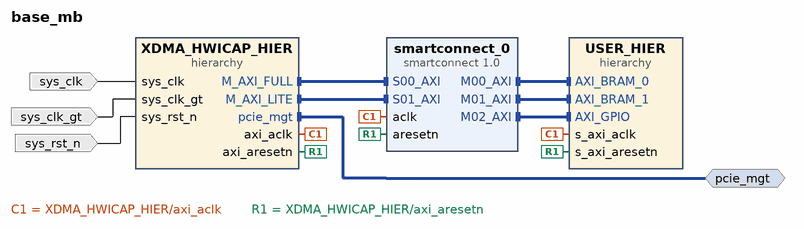
[diagram p0: block diagram of the top level]
# Vivado block design base_mb, xcku035-ffva1156-2-e, Vivado 2021.2
create_bd_design base_mb

create_bd_intf_port -mode Master -vlnv xilinx.com:interface:pcie_7x_mgt_rtl:1.0 pcie_mgt
create_bd_port -dir I -type rst sys_rst_n
create_bd_port -dir I -type clk sys_clk_gt
create_bd_port -dir I -type clk sys_clk

create_bd_cell -type hier XDMA_HWICAP_HIER
create_bd_cell -type ip -vlnv xilinx.com:ip:smartconnect:1.0 smartconnect_0
set_property -dict {CONFIG.NUM_MI 3 CONFIG.NUM_SI 2} [get_bd_cells smartconnect_0]
create_bd_cell -type hier USER_HIER

# ---- hierarchy /XDMA_HWICAP_HIER ----
current_bd_instance /XDMA_HWICAP_HIER
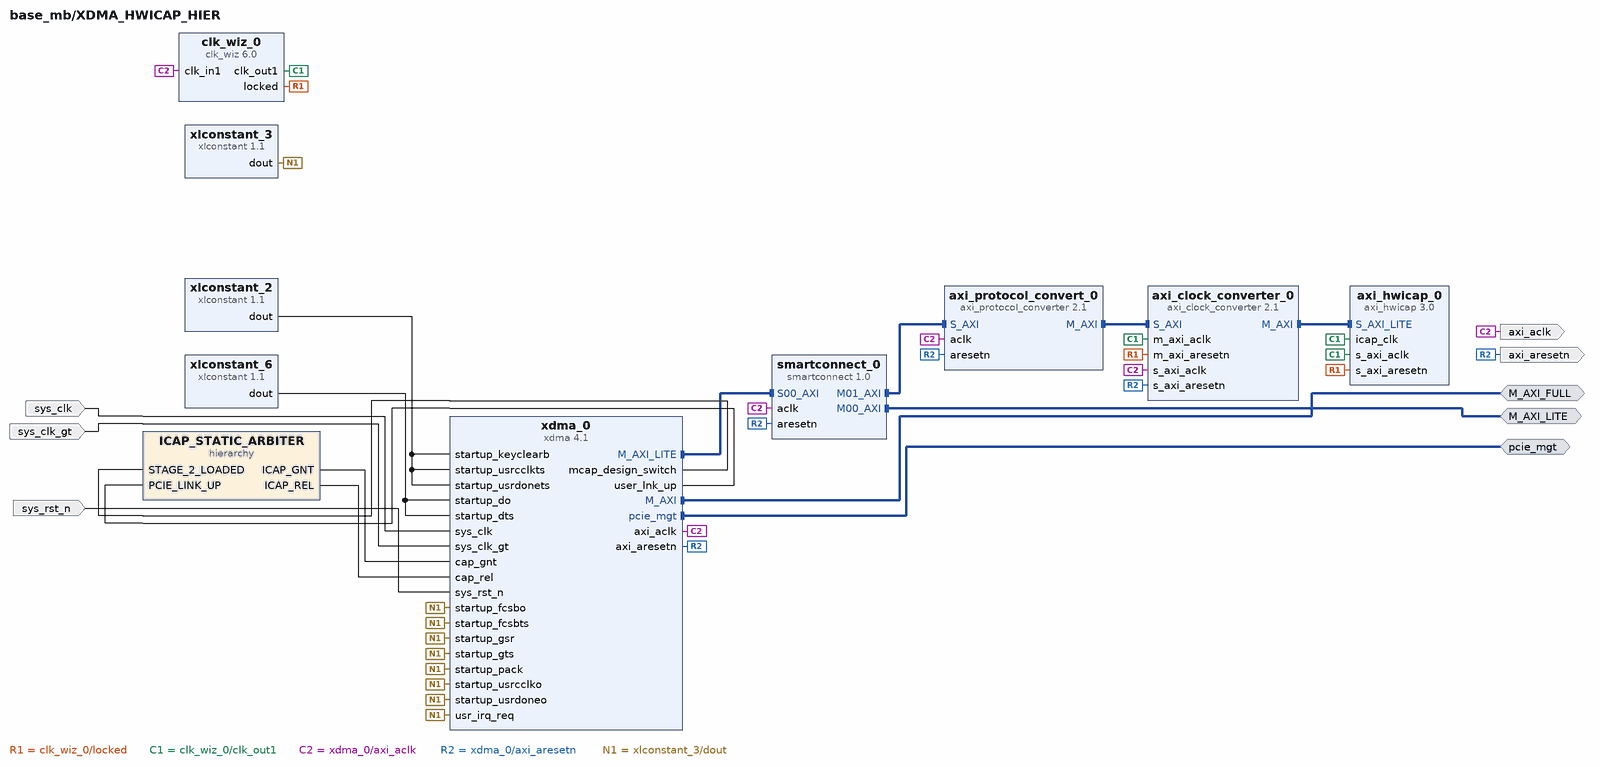
[diagram p1: block diagram inside /XDMA_HWICAP_HIER]
create_bd_intf_pin -mode Master -vlnv xilinx.com:interface:aximm_rtl:1.0 M_AXI_FULL
create_bd_intf_pin -mode Master -vlnv xilinx.com:interface:pcie_7x_mgt_rtl:1.0 pcie_mgt
create_bd_intf_pin -mode Master -vlnv xilinx.com:interface:aximm_rtl:1.0 M_AXI_LITE
create_bd_pin -dir I -type clk sys_clk
create_bd_pin -dir I -type clk sys_clk_gt
create_bd_pin -dir I -type rst sys_rst_n
create_bd_pin -dir O -type clk axi_aclk
create_bd_pin -dir O -type rst axi_aresetn

create_bd_cell -type ip -vlnv xilinx.com:ip:xlconstant:1.1 xlconstant_2
create_bd_cell -type ip -vlnv xilinx.com:ip:xdma:4.1 xdma_0
set_property -dict [list \
  CONFIG.PF0_DEVICE_ID_mqdma 9038 \
  CONFIG.PF0_SRIOV_VF_DEVICE_ID A038 \
  CONFIG.PF2_DEVICE_ID_mqdma 9238 \
  CONFIG.PF3_DEVICE_ID_mqdma 9338 \
  CONFIG.axi_data_width 256_bit \
  CONFIG.axilite_master_en true \
  CONFIG.axilite_master_scale Megabytes \
  CONFIG.axilite_master_size 1 \
  CONFIG.axisten_freq 250 \
  CONFIG.cfg_mgmt_if false \
  CONFIG.dedicate_perst true \
  CONFIG.dma_reset_source_sel Phy_Ready \
  CONFIG.en_gt_selection false \
  CONFIG.en_transceiver_status_ports false \
  CONFIG.enable_pcie_debug False \
  CONFIG.gtcom_in_core_usp 2 \
  CONFIG.mcap_enablement Tandem \
  CONFIG.mode_selection Advanced \
  CONFIG.pcie_blk_locn X0Y0 \
  CONFIG.pcie_extended_tag false \
  CONFIG.pciebar2axibar_axil_master 0xc0000000 \
  CONFIG.pf0_device_id 8038 \
  CONFIG.pf0_link_status_slot_clock_config true \
  CONFIG.pf0_msi_enabled false \
  CONFIG.pl_link_cap_max_link_speed 8.0_GT/s \
  CONFIG.pl_link_cap_max_link_width X8 \
  CONFIG.plltype QPLL1 \
  CONFIG.xdma_axi_intf_mm AXI_Memory_Mapped \
  CONFIG.xdma_axilite_slave false \
  CONFIG.xdma_sts_ports false \
] [get_bd_cells xdma_0]
create_bd_cell -type ip -vlnv xilinx.com:ip:xlconstant:1.1 xlconstant_3
set_property -dict {CONFIG.CONST_VAL 0} [get_bd_cells xlconstant_3]
create_bd_cell -type ip -vlnv xilinx.com:ip:xlconstant:1.1 xlconstant_6
set_property -dict {CONFIG.CONST_VAL 0 CONFIG.CONST_WIDTH 4} [get_bd_cells xlconstant_6]
create_bd_cell -type hier ICAP_STATIC_ARBITER
create_bd_cell -type ip -vlnv xilinx.com:ip:axi_clock_converter:2.1 axi_clock_converter_0
create_bd_cell -type ip -vlnv xilinx.com:ip:axi_protocol_converter:2.1 axi_protocol_convert_0
set_property -dict [list \
  CONFIG.MI_PROTOCOL AXI4LITE \
  CONFIG.SI_PROTOCOL AXI4 \
  CONFIG.TRANSLATION_MODE 2 \
] [get_bd_cells axi_protocol_convert_0]
create_bd_cell -type ip -vlnv xilinx.com:ip:clk_wiz:6.0 clk_wiz_0
set_property -dict [list \
  CONFIG.AUTO_PRIMITIVE PLL \
  CONFIG.CLKOUT1_DRIVES Buffer \
  CONFIG.CLKOUT1_JITTER 107.111 \
  CONFIG.CLKOUT1_PHASE_ERROR 85.928 \
  CONFIG.CLKOUT2_DRIVES Buffer \
  CONFIG.CLKOUT3_DRIVES Buffer \
  CONFIG.CLKOUT4_DRIVES Buffer \
  CONFIG.CLKOUT5_DRIVES Buffer \
  CONFIG.CLKOUT6_DRIVES Buffer \
  CONFIG.CLKOUT7_DRIVES Buffer \
  CONFIG.FEEDBACK_SOURCE FDBK_AUTO \
  CONFIG.MMCM_BANDWIDTH OPTIMIZED \
  CONFIG.MMCM_CLKFBOUT_MULT_F 4 \
  CONFIG.MMCM_CLKIN1_PERIOD 4.000 \
  CONFIG.MMCM_CLKIN2_PERIOD 10.0 \
  CONFIG.MMCM_CLKOUT0_DIVIDE_F 10 \
  CONFIG.MMCM_COMPENSATION AUTO \
  CONFIG.OPTIMIZE_CLOCKING_STRUCTURE_EN true \
  CONFIG.PRIMITIVE Auto \
  CONFIG.USE_LOCKED true \
  CONFIG.USE_RESET false \
] [get_bd_cells clk_wiz_0]
create_bd_cell -type ip -vlnv xilinx.com:ip:axi_hwicap:3.0 axi_hwicap_0
create_bd_cell -type ip -vlnv xilinx.com:ip:smartconnect:1.0 smartconnect_0
set_property -dict {CONFIG.NUM_CLKS 1 CONFIG.NUM_MI 2 CONFIG.NUM_SI 1} [get_bd_cells smartconnect_0]

# ---- hierarchy /XDMA_HWICAP_HIER/ICAP_STATIC_ARBITER ----
current_bd_instance /XDMA_HWICAP_HIER/ICAP_STATIC_ARBITER
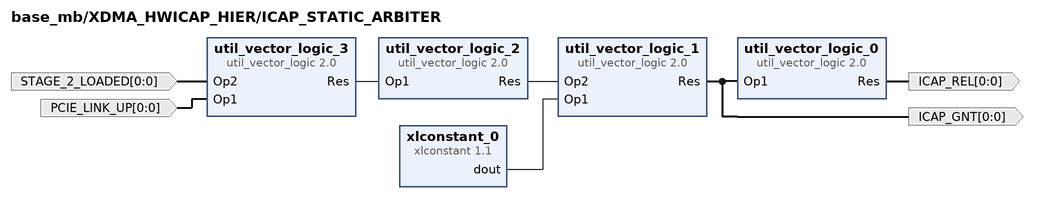
[diagram p2: block diagram inside /XDMA_HWICAP_HIER/ICAP_STATIC_ARBITER]
create_bd_pin -dir O -from 0 -to 0 ICAP_GNT
create_bd_pin -dir I -from 0 -to 0 PCIE_LINK_UP
create_bd_pin -dir I -from 0 -to 0 STAGE_2_LOADED
create_bd_pin -dir O -from 0 -to 0 ICAP_REL

create_bd_cell -type ip -vlnv xilinx.com:ip:xlconstant:1.1 xlconstant_0
create_bd_cell -type ip -vlnv xilinx.com:ip:util_vector_logic:2.0 util_vector_logic_1
set_property -dict {CONFIG.C_SIZE 1} [get_bd_cells util_vector_logic_1]
create_bd_cell -type ip -vlnv xilinx.com:ip:util_vector_logic:2.0 util_vector_logic_2
set_property -dict {CONFIG.C_OPERATION not CONFIG.C_SIZE 1} [get_bd_cells util_vector_logic_2]
create_bd_cell -type ip -vlnv xilinx.com:ip:util_vector_logic:2.0 util_vector_logic_3
set_property -dict {CONFIG.C_SIZE 1} [get_bd_cells util_vector_logic_3]
create_bd_cell -type ip -vlnv xilinx.com:ip:util_vector_logic:2.0 util_vector_logic_0
set_property -dict {CONFIG.C_OPERATION not CONFIG.C_SIZE 1} [get_bd_cells util_vector_logic_0]

# ---- hierarchy /USER_HIER ----
current_bd_instance /USER_HIER
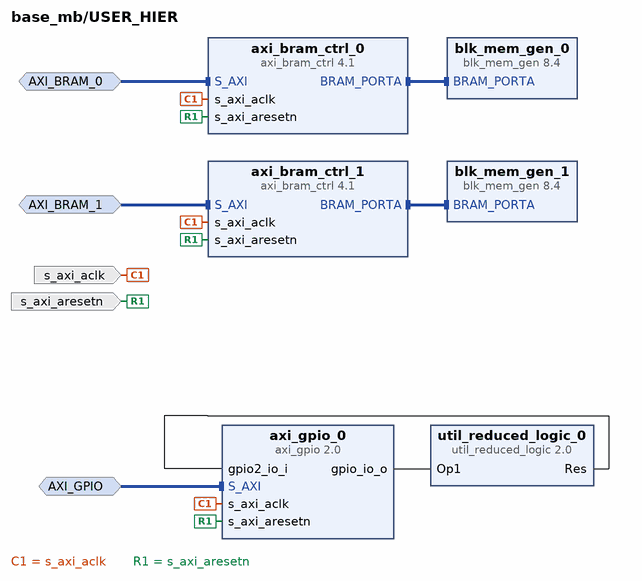
[diagram p3: block diagram inside /USER_HIER]
create_bd_intf_pin -mode Slave -vlnv xilinx.com:interface:aximm_rtl:1.0 AXI_BRAM_0
create_bd_intf_pin -mode Slave -vlnv xilinx.com:interface:aximm_rtl:1.0 AXI_BRAM_1
create_bd_intf_pin -mode Slave -vlnv xilinx.com:interface:aximm_rtl:1.0 AXI_GPIO
create_bd_pin -dir I -type clk s_axi_aclk
create_bd_pin -dir I -type rst s_axi_aresetn

create_bd_cell -type ip -vlnv xilinx.com:ip:axi_bram_ctrl:4.1 axi_bram_ctrl_0
set_property -dict {CONFIG.DATA_WIDTH 256 CONFIG.SINGLE_PORT_BRAM 1} [get_bd_cells axi_bram_ctrl_0]
create_bd_cell -type ip -vlnv xilinx.com:ip:axi_bram_ctrl:4.1 axi_bram_ctrl_1
set_property -dict {CONFIG.SINGLE_PORT_BRAM 1} [get_bd_cells axi_bram_ctrl_1]
create_bd_cell -type ip -vlnv xilinx.com:ip:axi_gpio:2.0 axi_gpio_0
set_property -dict [list \
  CONFIG.C_ALL_INPUTS_2 1 \
  CONFIG.C_ALL_OUTPUTS 1 \
  CONFIG.C_GPIO2_WIDTH 1 \
  CONFIG.C_GPIO_WIDTH 2 \
  CONFIG.C_IS_DUAL 1 \
] [get_bd_cells axi_gpio_0]
create_bd_cell -type ip -vlnv xilinx.com:ip:blk_mem_gen:8.4 blk_mem_gen_0
set_property -dict [list \
  CONFIG.EN_SAFETY_CKT false \
  CONFIG.Memory_Type Single_Port_RAM \
  CONFIG.Port_B_Clock 0 \
  CONFIG.Port_B_Enable_Rate 0 \
  CONFIG.Port_B_Write_Rate 0 \
] [get_bd_cells blk_mem_gen_0]
create_bd_cell -type ip -vlnv xilinx.com:ip:blk_mem_gen:8.4 blk_mem_gen_1
set_property -dict {CONFIG.EN_SAFETY_CKT false} [get_bd_cells blk_mem_gen_1]
create_bd_cell -type ip -vlnv xilinx.com:ip:util_reduced_logic:2.0 util_reduced_logic_0
set_property -dict {CONFIG.C_SIZE 2} [get_bd_cells util_reduced_logic_0]

# ---- connections ----

current_bd_instance /XDMA_HWICAP_HIER
connect_bd_intf_net [get_bd_intf_pins M_AXI_LITE] [get_bd_intf_pins smartconnect_0/M00_AXI]
connect_bd_intf_net [get_bd_intf_pins axi_clock_converter_0/M_AXI] [get_bd_intf_pins axi_hwicap_0/S_AXI_LITE]
connect_bd_intf_net [get_bd_intf_pins axi_protocol_convert_0/M_AXI] [get_bd_intf_pins axi_clock_converter_0/S_AXI]
connect_bd_intf_net [get_bd_intf_pins smartconnect_0/M01_AXI] [get_bd_intf_pins axi_protocol_convert_0/S_AXI]
connect_bd_intf_net [get_bd_intf_pins M_AXI_FULL] [get_bd_intf_pins xdma_0/M_AXI]
connect_bd_intf_net [get_bd_intf_pins xdma_0/M_AXI_LITE] [get_bd_intf_pins smartconnect_0/S00_AXI]
connect_bd_intf_net [get_bd_intf_pins pcie_mgt] [get_bd_intf_pins xdma_0/pcie_mgt]
connect_bd_net [get_bd_pins ICAP_STATIC_ARBITER/ICAP_GNT] [get_bd_pins xdma_0/cap_gnt]
connect_bd_net [get_bd_pins ICAP_STATIC_ARBITER/ICAP_REL] [get_bd_pins xdma_0/cap_rel]
connect_bd_net [get_bd_pins clk_wiz_0/locked] [get_bd_pins axi_hwicap_0/s_axi_aresetn] [get_bd_pins axi_clock_converter_0/m_axi_aresetn]
connect_bd_net [get_bd_pins clk_wiz_0/clk_out1] \
  [get_bd_pins axi_hwicap_0/icap_clk] [get_bd_pins axi_hwicap_0/s_axi_aclk] [get_bd_pins axi_clock_converter_0/m_axi_aclk]
connect_bd_net -net sys_clk_0_1 [get_bd_pins sys_clk] [get_bd_pins xdma_0/sys_clk]
connect_bd_net -net sys_clk_gt_0_1 [get_bd_pins sys_clk_gt] [get_bd_pins xdma_0/sys_clk_gt]
connect_bd_net [get_bd_pins sys_rst_n] [get_bd_pins xdma_0/sys_rst_n]
connect_bd_net [get_bd_pins xdma_0/axi_aclk] \
  [get_bd_pins axi_aclk] [get_bd_pins axi_protocol_convert_0/aclk] [get_bd_pins clk_wiz_0/clk_in1] \
  [get_bd_pins axi_clock_converter_0/s_axi_aclk] [get_bd_pins smartconnect_0/aclk]
connect_bd_net [get_bd_pins xdma_0/axi_aresetn] \
  [get_bd_pins axi_aresetn] [get_bd_pins axi_protocol_convert_0/aresetn] [get_bd_pins axi_clock_converter_0/s_axi_aresetn] \
  [get_bd_pins smartconnect_0/aresetn]
connect_bd_net [get_bd_pins xdma_0/mcap_design_switch] [get_bd_pins ICAP_STATIC_ARBITER/STAGE_2_LOADED]
connect_bd_net [get_bd_pins xdma_0/user_lnk_up] [get_bd_pins ICAP_STATIC_ARBITER/PCIE_LINK_UP]
connect_bd_net [get_bd_pins xlconstant_2/dout] \
  [get_bd_pins xdma_0/startup_keyclearb] [get_bd_pins xdma_0/startup_usrcclkts] [get_bd_pins xdma_0/startup_usrdonets]
connect_bd_net [get_bd_pins xlconstant_3/dout] \
  [get_bd_pins xdma_0/usr_irq_req] [get_bd_pins xdma_0/startup_fcsbo] [get_bd_pins xdma_0/startup_fcsbts] \
  [get_bd_pins xdma_0/startup_gsr] [get_bd_pins xdma_0/startup_gts] [get_bd_pins xdma_0/startup_pack] \
  [get_bd_pins xdma_0/startup_usrcclko] [get_bd_pins xdma_0/startup_usrdoneo]
connect_bd_net [get_bd_pins xlconstant_6/dout] [get_bd_pins xdma_0/startup_do] [get_bd_pins xdma_0/startup_dts]

current_bd_instance /XDMA_HWICAP_HIER/ICAP_STATIC_ARBITER
connect_bd_net [get_bd_pins util_vector_logic_0/Res] [get_bd_pins ICAP_REL]
connect_bd_net [get_bd_pins util_vector_logic_1/Res] [get_bd_pins ICAP_GNT] [get_bd_pins util_vector_logic_0/Op1]
connect_bd_net [get_bd_pins util_vector_logic_2/Res] [get_bd_pins util_vector_logic_1/Op2]
connect_bd_net [get_bd_pins util_vector_logic_3/Res] [get_bd_pins util_vector_logic_2/Op1]
connect_bd_net -net xdma_0_mcap_design_switch [get_bd_pins STAGE_2_LOADED] [get_bd_pins util_vector_logic_3/Op2]
connect_bd_net -net xdma_0_user_lnk_up [get_bd_pins PCIE_LINK_UP] [get_bd_pins util_vector_logic_3/Op1]
connect_bd_net [get_bd_pins xlconstant_0/dout] [get_bd_pins util_vector_logic_1/Op1]

current_bd_instance /USER_HIER
connect_bd_intf_net [get_bd_intf_pins blk_mem_gen_0/BRAM_PORTA] [get_bd_intf_pins axi_bram_ctrl_0/BRAM_PORTA]
connect_bd_intf_net [get_bd_intf_pins blk_mem_gen_1/BRAM_PORTA] [get_bd_intf_pins axi_bram_ctrl_1/BRAM_PORTA]
connect_bd_intf_net -intf_net smartconnect_0_M00_AXI [get_bd_intf_pins AXI_GPIO] [get_bd_intf_pins axi_gpio_0/S_AXI]
connect_bd_intf_net -intf_net smartconnect_0_M01_AXI [get_bd_intf_pins AXI_BRAM_1] [get_bd_intf_pins axi_bram_ctrl_1/S_AXI]
connect_bd_intf_net -intf_net smartconnect_0_M02_AXI [get_bd_intf_pins AXI_BRAM_0] [get_bd_intf_pins axi_bram_ctrl_0/S_AXI]
connect_bd_net [get_bd_pins axi_gpio_0/gpio_io_o] [get_bd_pins util_reduced_logic_0/Op1]
connect_bd_net [get_bd_pins util_reduced_logic_0/Res] [get_bd_pins axi_gpio_0/gpio2_io_i]
connect_bd_net -net xdma_0_axi_aclk [get_bd_pins s_axi_aclk] \
  [get_bd_pins axi_bram_ctrl_1/s_axi_aclk] [get_bd_pins axi_gpio_0/s_axi_aclk] [get_bd_pins axi_bram_ctrl_0/s_axi_aclk]
connect_bd_net -net xdma_0_axi_aresetn [get_bd_pins s_axi_aresetn] \
  [get_bd_pins axi_bram_ctrl_1/s_axi_aresetn] [get_bd_pins axi_gpio_0/s_axi_aresetn] \
  [get_bd_pins axi_bram_ctrl_0/s_axi_aresetn]

current_bd_instance /
connect_bd_intf_net [get_bd_intf_pins XDMA_HWICAP_HIER/M_AXI_FULL] [get_bd_intf_pins smartconnect_0/S00_AXI]
connect_bd_intf_net [get_bd_intf_pins XDMA_HWICAP_HIER/M_AXI_LITE] [get_bd_intf_pins smartconnect_0/S01_AXI]
connect_bd_intf_net [get_bd_intf_pins smartconnect_0/M00_AXI] [get_bd_intf_pins USER_HIER/AXI_BRAM_0]
connect_bd_intf_net [get_bd_intf_pins smartconnect_0/M01_AXI] [get_bd_intf_pins USER_HIER/AXI_BRAM_1]
connect_bd_intf_net [get_bd_intf_pins smartconnect_0/M02_AXI] [get_bd_intf_pins USER_HIER/AXI_GPIO]
connect_bd_intf_net -intf_net xdma_0_pcie_mgt [get_bd_intf_ports pcie_mgt] [get_bd_intf_pins XDMA_HWICAP_HIER/pcie_mgt]
connect_bd_net -net sys_clk_0_1 [get_bd_ports sys_clk] [get_bd_pins XDMA_HWICAP_HIER/sys_clk]
connect_bd_net -net sys_clk_gt_0_1 [get_bd_ports sys_clk_gt] [get_bd_pins XDMA_HWICAP_HIER/sys_clk_gt]
connect_bd_net [get_bd_ports sys_rst_n] [get_bd_pins XDMA_HWICAP_HIER/sys_rst_n]
connect_bd_net -net xdma_0_axi_aclk [get_bd_pins XDMA_HWICAP_HIER/axi_aclk] [get_bd_pins smartconnect_0/aclk] [get_bd_pins USER_HIER/s_axi_aclk]
connect_bd_net -net xdma_0_axi_aresetn [get_bd_pins XDMA_HWICAP_HIER/axi_aresetn] \
  [get_bd_pins smartconnect_0/aresetn] [get_bd_pins USER_HIER/s_axi_aresetn]

# ---- address map ----
assign_bd_address -offset 0x00000000C0000000 -range 32K -target_address_space [get_bd_addr_spaces XDMA_HWICAP_HIER/xdma_0/M_AXI] [get_bd_addr_segs USER_HIER/axi_bram_ctrl_0/S_AXI/Mem0]
exclude_bd_addr_seg -offset 0x00000000C0000000 -range 64K -target_address_space [get_bd_addr_spaces XDMA_HWICAP_HIER/xdma_0/M_AXI] [get_bd_addr_segs USER_HIER/axi_bram_ctrl_1/S_AXI/Mem0]
exclude_bd_addr_seg -offset 0x00000000C0010000 -range 64K -target_address_space [get_bd_addr_spaces XDMA_HWICAP_HIER/xdma_0/M_AXI] [get_bd_addr_segs USER_HIER/axi_gpio_0/S_AXI/Reg]
assign_bd_address -offset 0xC0000000 -range 64K -target_address_space [get_bd_addr_spaces XDMA_HWICAP_HIER/xdma_0/M_AXI_LITE] [get_bd_addr_segs USER_HIER/axi_bram_ctrl_1/S_AXI/Mem0]
assign_bd_address -offset 0xC0010000 -range 64K -target_address_space [get_bd_addr_spaces XDMA_HWICAP_HIER/xdma_0/M_AXI_LITE] [get_bd_addr_segs USER_HIER/axi_gpio_0/S_AXI/Reg]
assign_bd_address -offset 0xC0020000 -range 64K -target_address_space [get_bd_addr_spaces XDMA_HWICAP_HIER/xdma_0/M_AXI_LITE] [get_bd_addr_segs XDMA_HWICAP_HIER/axi_hwicap_0/S_AXI_LITE/Reg]
exclude_bd_addr_seg -offset 0xC0000000 -range 32K -target_address_space [get_bd_addr_spaces XDMA_HWICAP_HIER/xdma_0/M_AXI_LITE] [get_bd_addr_segs USER_HIER/axi_bram_ctrl_0/S_AXI/Mem0]

validate_bd_design
save_bd_design
